# EAGLE design power_board (EAGLE 9.2.2)
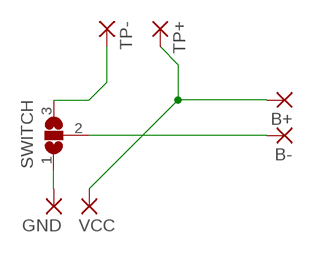
[diagram p0: schematic, sheet 1]

## Parts
B+  SMD2  [SMD1,27-2,54]
B-  SMD2  [SMD1,27-2,54]
GND  SMD2  [SMD1,27-2,54]
SWITCH  SJ2WW  [SJ_2W]
TP+  SMD2  [SMD1,27-2,54]
TP-  SMD2  [SMD1,27-2,54]
VCC  SMD2  [SMD1,27-2,54]

## Nets
N$2: B-.1(P) SWITCH.2
N$3: GND.1(P) SWITCH.1
N$4: B+.1(P) TP+.1(P) VCC.1(P)
N$5: SWITCH.3 TP-.1(P)

## Library data of the parts
B+ B- GND TP+ TP- VCC = wirepad:SMD2: SMD PAD
SWITCH = jumper:SJ2W: SMD solder JUMPER

## Net classes
0 default: width 0.508 mm, drill 0.508 mm, clearance 0.254 mm

## Board
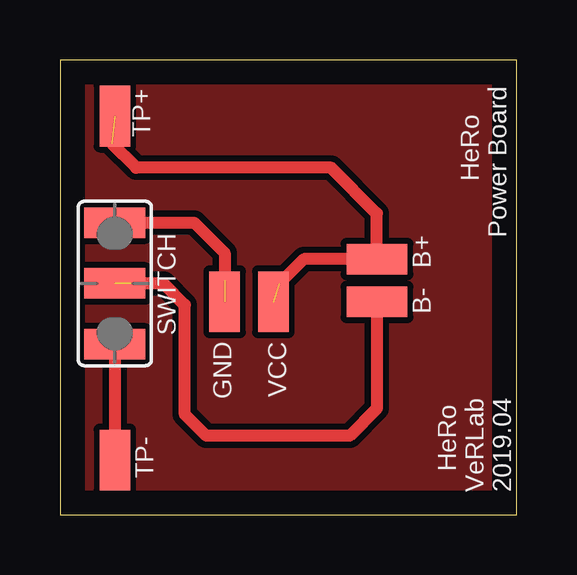
[diagram p1: board, top side]

Size 19.03 x 18.97 mm. Coordinates in mm from the lower left corner, seen from the top.
Outline: 0,0 19.03,0 19.03,18.97 0,18.97 0,0
Copper layers (1*16): Top 0.035mm / dielectric 1.5mm / Bottom 0.035mm
Design rules "default": minimum track width 6mil, minimum drill 0.35mm, track to track 6mil, track to pad 6mil, pad to pad 6mil, via to via 6mil, smd to smd 6mil, copper to edge 40mil, drill to drill 6mil, minimum pad ring 10mil, minimum via ring 8mil, stop-mask expansion 4mil, vias tented up to drill 0mil, thermal gap 10mil

### Footprints (pad centres in the part's own frame; a part is rotated, then mirrored left to right if it is on the bottom)
SMD1,27-2,54 = smd 1.27 x 2.54: 1 0,0
SJ_2W = smd 1.27 x 2.54: 1 -2.54,0; 2 0,0; 3 2.54,0

### Placement (x,y rotation side)
B+  13.21,10.67 90 top
B-  13.21,8.89 90 top
GND  6.86,8.89 180 top
SWITCH  2.29,9.65 270 top
TP+  2.29,16.64 180 top
TP-  2.29,2.29 180 top
VCC  8.89,8.89 180 top

### Tracks (layer width: path | path; a pad name or v marks a point on that pad's centre or on a via)
GND
  pour Top: -0.25,18.03 -0.25,0.76 19.3,0.76 19.3,18.03
  pour Top: -0.64,18.54 -0.64,0.38 19.68,0.38 19.68,18.41 19.56,18.54
N$2  (1 unrouted)
  Top 0.508: B-.1 13.21,4.45 12.06,3.3 6.1,3.3 5.21,4.19 5.21,8.76 4.32,9.65 3.17,9.65
N$3  (1 unrouted)
  Top 0.508: SWITCH.1 5.59,12.19 6.86,10.92 6.86,9.78
N$4  (2 unrouted)
  Top 0.508: 9.14,9.65 10.16,10.67 B+.1 13.21,12.57 11.3,14.48 3.17,14.48 2.16,15.49
N$5
  Top 0.508: SWITCH.3 TP-.1

### Text on the board
tPlace: HeRo / Power Board | HeRo / VeRLab / 2019.04